# Altium project Custome Arduino Zlab_Fanap.PrjPcb
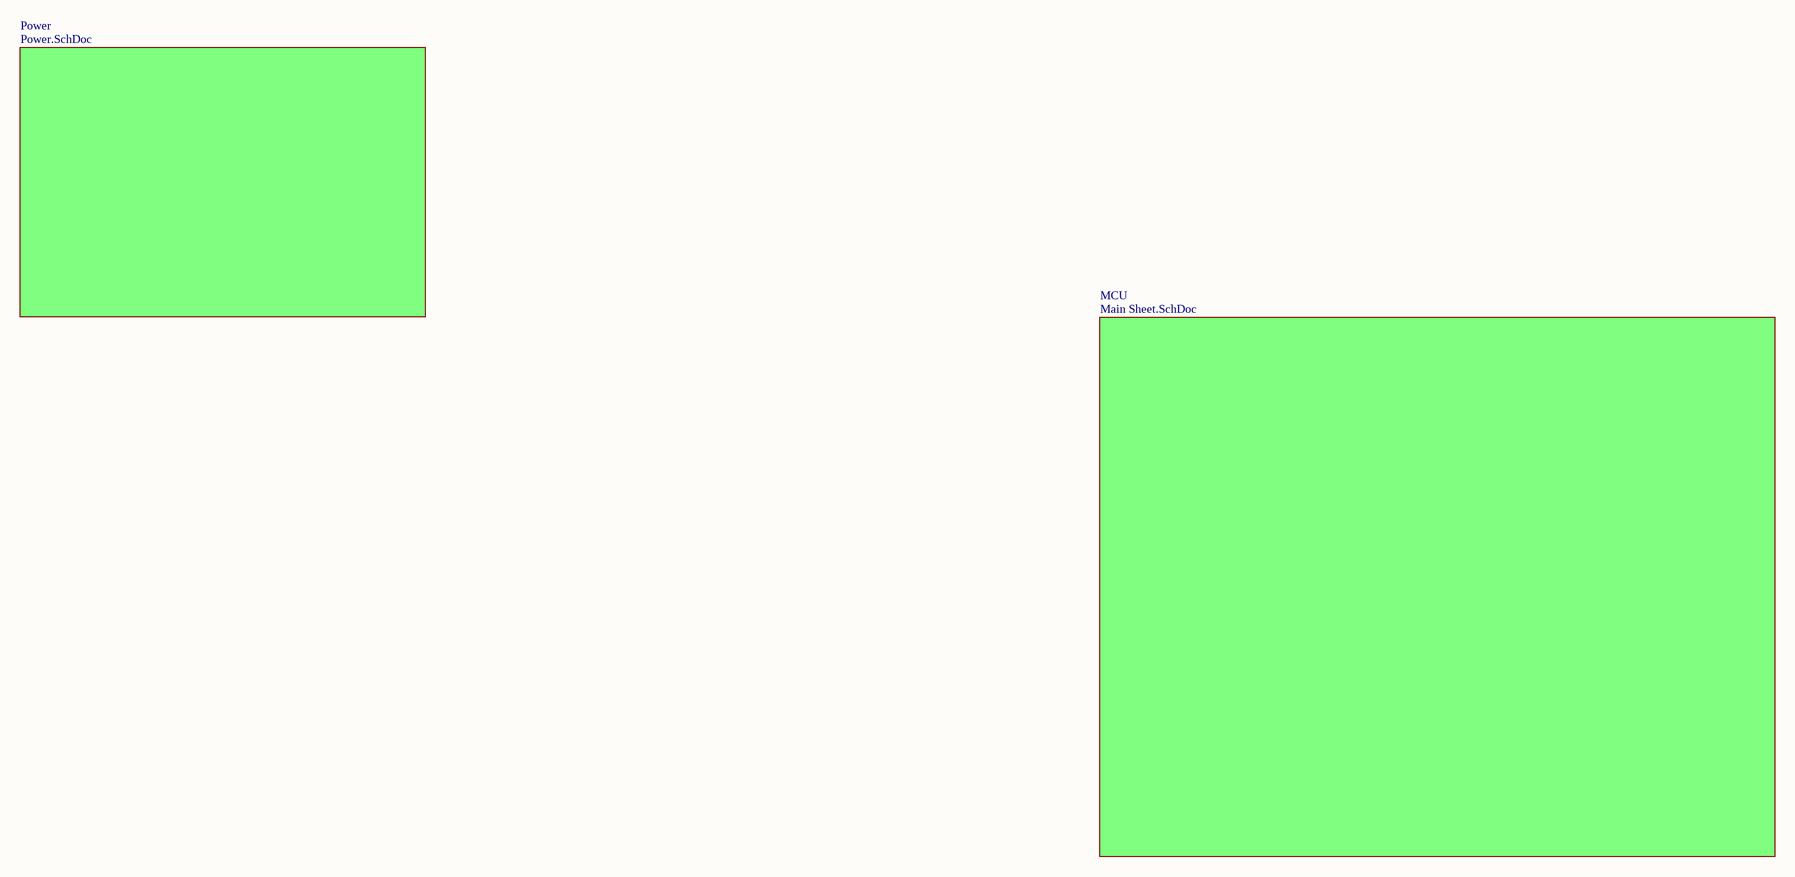
[diagram p0: Block Diagram.SchDoc]
3 sheets, 64 parts. Net scope: global (net labels, ports and power ports of the same name join across sheets).
Board file: Custome Arduino Zlab_Fanap.PcbDoc
Sheets:
  Block Diagram.SchDoc
    Power = Power.SchDoc
    MCU = Main Sheet.SchDoc

## Sheet Block Diagram.SchDoc
size 420 x 297 mm; SheetNumber: 1; SheetTotal: 3

### Sub-sheets
MCU = Main Sheet.SchDoc: no entries
Power = Power.SchDoc: no entries

### Notes on the sheet
- THIS DOCUMENT AND THE DATA DISCLOSED HEREIN OR
- HEREWITH IS THE PROPERTY OF ALTIUM LIMITED AND MAY
- DWG NO:
- REVISION
- REV:
- DESCRIPTION
- DATE
- APPROVED
- BE FREELY DISTRIBUTED IN WHOLE. NO RIGHTS ARE
- RESERVED OR EXPRESS OR IMPLIED WARANTEE GIVEN.
- ENG:
- APPROVALS
- PROJECT
- DSN:
- CHK:
- REFERENCE DOCUMENTS
- PROJECT REVISION:
- TITLE
- DOCUMENT REVISION:
- DESIGN ITEM:
- BOM:
- FAB DWG:
- PCB DWG:
- ASSY DWG:
- SCALE:
- A3
- SIZE
- CAGE CODE
- FILE NAME
- DWG NO.
- SHEET
- OF
- REV

## Sheet Power.SchDoc
size 420 x 297 mm; SheetNumber: 2; SheetTotal: 3
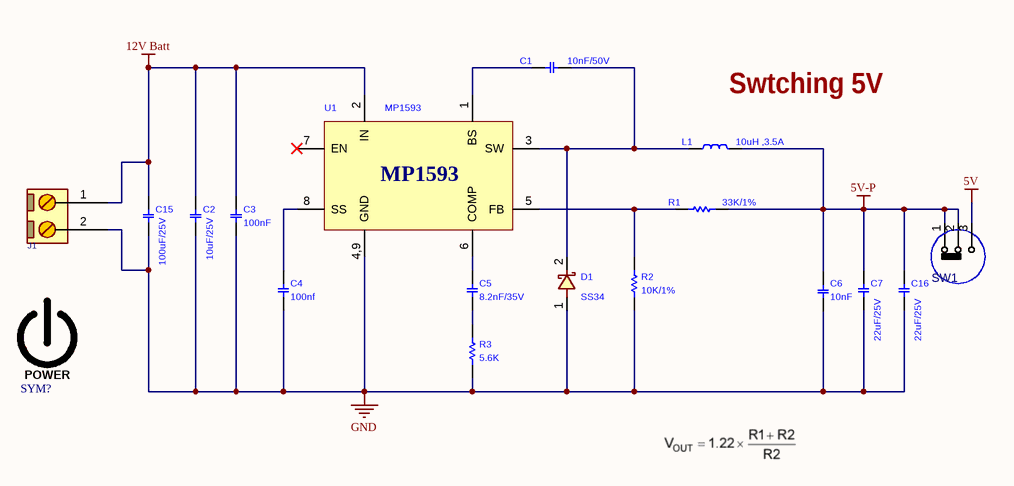
[diagram p1: Power.SchDoc]

### Parts
C1  10nF/50V  [C0603S]
C2  10uF/25V  [C0805S]
C3  100nF  [C0603S]
C4  100nf  [C0603S]
C5  8.2nF/35V  [C0603S]
C6  10nF  [C0603S]
C7  22uF/25V  [C0805S]
C15  100uF/25V  [C1206S]
C16  22uF/25V  [C0805S]
D1  SS34  [D_SMA]
J1  CONN_TB2  [TBG_2]  (value not drawn)
L1  10uH ,3.5A  [L_4_H2]
R1  33K/1%  [R0603S]
R2  10K/1%  [R0603S]
R3  5.6K  [R0603S]
SW1  SlideSwitch  [SWSLIDT_SPDT_R_8X4]  (value not drawn)
SYM?  POWER  [SYM_POWER]  (value not drawn)  (graphical)
U1  MP1593  [SO_8T]

### Nets
5V: SW1.3(P4)
5V-P: C6.2 C7.2 C16.2 L1.2 R1.1 SW1.1(P1) SW1.2(P3)
12V Batt: C2.2 C3.2 C15.2 J1.1 U1.2(IN)
GND: C2.1 C3.1 C4.1 C6.1 C7.1 C15.1 C16.1 D1.1 J1.2 R2.1 R3.1 U1.4,9(GND)
NetC1_1: C1.1 D1.2 L1.1 U1.3(SW)
NetC1_2: C1.2 U1.1(BS)
NetC4_2: C4.2 U1.8(SS)
NetC5_1: C5.1 R3.2
NetC5_2: C5.2 U1.6(COMP)
NetR1_2: R1.2 R2.2 U1.5(FB)

Not connected (* = marked no-connect by the designer): U1 7(EN)*

### Notes on the sheet
- (near L1) Swtching 5V
- THIS DOCUMENT AND THE DATA DISCLOSED HEREIN OR
- HEREWITH IS THE PROPERTY OF ALTIUM LIMITED AND MAY
- DWG NO:
- REVISION
- REV:
- DESCRIPTION
- DATE
- APPROVED
- BE FREELY DISTRIBUTED IN WHOLE. NO RIGHTS ARE
- RESERVED OR EXPRESS OR IMPLIED WARANTEE GIVEN.
- ENG:
- APPROVALS
- PROJECT
- DSN:
- CHK:
- REFERENCE DOCUMENTS
- PROJECT REVISION:
- TITLE
- DOCUMENT REVISION:
- DESIGN ITEM:
- BOM:
- FAB DWG:
- PCB DWG:
- ASSY DWG:
- SCALE:
- A3
- SIZE
- CAGE CODE
- FILE NAME
- DWG NO.
- SHEET
- OF
- REV

### Library data of the parts
C1 C6 = CAP_SMD_MLCC_0603: CAP, MLCC, SMD; MANF_P#: x; MA: MA010200501; MANF: x; ASSEMBLY: ASSEMBLY; Pricing: 1=0.44, 10=0.34; Published: 31-Dec-2024; Publisher: CHILA Board; LatestRevisionDate: 31-Dec-2024; LatestRevisionNote: Re-released for DXP Platform.; PackageReference: x; footprint: x; package: 0603
  C1: VALUE: 10nF/50V
  C6: VALUE: 10nF
C2 C15 = CAP_SMD_MLCC_0603: CAP, MLCC, SMD; MANF_P#: x; MA: MA010200491; MANF: x; ASSEMBLY: ASSEMBLY; Pricing: 1=0.44, 10=0.34; Published: 31-Dec-2024; Publisher: CHILA Board; LatestRevisionDate: 31-Dec-2024; LatestRevisionNote: Re-released for DXP Platform.; PackageReference: x; footprint: x; package: 0603
  C2: VALUE: 10uF/25V
  C15: VALUE: 100uF/25V
C3 C4 = CAP_SMD_MLCC_0603: CAP, MLCC, SMD; MANF_P#: x; MA: MA010210354; MANF: x; ASSEMBLY: ASSEMBLY; Pricing: 1=0.44, 10=0.34; Published: 31-Dec-2024; Publisher: CHILA Board; LatestRevisionDate: 31-Dec-2024; LatestRevisionNote: Re-released for DXP Platform.; PackageReference: x; footprint: x; package: 0603
  C3: VALUE: 100nF
  C4: VALUE: 100nf
C5 = CAP_SMD_MLCC_0603: CAP, MLCC, SMD; MANF_P#: x; MA: MA010210616; MANF: x; ASSEMBLY: ASSEMBLY; VALUE: 8.2nF/35V; Pricing: 1=0.44, 10=0.34; Published: 31-Dec-2024; Publisher: CHILA Board; LatestRevisionDate: 31-Dec-2024; LatestRevisionNote: Re-released for DXP Platform.; PackageReference: x; footprint: x; package: 0603
C7 C16 = CAP_SMD_MLCC_0603: CAP, MLCC, SMD; MANF_P#: x; MA: MA010200438; MANF: x; ASSEMBLY: ASSEMBLY; VALUE: 22uF/25V; Pricing: 1=0.44, 10=0.34; Published: 31-Dec-2024; Publisher: CHILA Board; LatestRevisionDate: 31-Dec-2024; LatestRevisionNote: Re-released for DXP Platform.; PackageReference: x; footprint: x; package: 0805
D1 = DIODE_SMD_SCHOTTKY_B340A: DIODE, SCHOTTKY, 40V, 3A; MANF: x; MA: MA010400129; MANF_P#: x; ASSEMBLY: ASSEMBLY; VALUE: SS34; Pricing: 1=0.44, 10=0.34; Published: 31-Dec-2024; Publisher: CHILA Board; LatestRevisionDate: 31-Dec-2024; LatestRevisionNote: Re-released for DXP Platform.; PackageReference: x; footprint: x; package: SMA
J1 = CONN_TB2: CONN, TERMINAL BLOCK, 5.08mm pitch; VALUE: CONN_TB2
L1 = TMPC 0603H-100MG-D: Shielded Molded Inductor, SMD; MA: MA011210087; MANF: x; Pricing: 1=0.44, 10=0.34; ASSEMBLY: ASSEMBLY; MANF_P#: x; Published: 31-Dec-2024; Publisher: CHILA Board; Value: 10uH ,3.5A; LatestRevisionDate: 31-Dec-2024; LatestRevisionNote: Re-released for DXP Platform.; PackageReference: x; footprint: x; package: Inductor 8*8
R1 = RES_SMD_0603: RESISTOR, SMD; MANF_P#: x; MA: MA010110563; MANF: x; ASSEMBLY: ASSEMBLY; VALUE: 33K/1%; Pricing: 1=0.44, 10=0.34; Published: 31-Dec-2024; Publisher: CHILA Board; LatestRevisionDate: 31-Dec-2024; LatestRevisionNote: Re-released for DXP Platform.; PackageReference: x; footprint: x; package: 0603
R2 = RES_SMD_0603: RESISTOR, SMD; MANF_P#: x; MA: MA010110324; MANF: x; ASSEMBLY: ASSEMBLY; VALUE: 10K/1%; Pricing: 1=0.44, 10=0.34; Published: 31-Dec-2024; Publisher: CHILA Board; LatestRevisionDate: 31-Dec-2024; LatestRevisionNote: Re-released for DXP Platform.; PackageReference: x; footprint: x; package: 0603
R3 = RES_SMD_0603: RESISTOR, SMD; MANF_P#: x; MA: MA010110557; MANF: x; ASSEMBLY: ASSEMBLY; VALUE: 5.6K; Pricing: 1=0.44, 10=0.34; Published: 31-Dec-2024; Publisher: CHILA Board; LatestRevisionDate: 31-Dec-2024; LatestRevisionNote: Re-released for DXP Platform.; PackageReference: x; footprint: x; package: 0603
SW1 = SWSLIDT_SPDT_S_8X4: SWITCH, SLIDE, SPDT, 8.6X4.3mm, THD; MANF_PART#: OS102011MS2QN1; MANF: C&K; DESC: DESCRIPTION; VALUE: SlideSwitch; ASSEMBLY: ASSEMBLY; PARAM: PARAM; PRICE: 0.4$
SYM? = SYM_POWER: Symbol, POWER, 4.6X6.3mm; ASSEMBLY: DNP; VALUE: POWER
U1 = MP1593DN: IC REG BUCK ADJ 3A SYNC; MA: MA010510512; MANF: x; Pricing: 1=0.44, 10=0.34; ComponentLink1URL: http://www.mouser.com/ds/2/277/MP1593_r2.11-476720.pdf?src-supplier=Mouser; ASSEMBLY: ASSEMBLY; MANF_P#: x; Published: 31-Dec-2024; Publisher: CHILA Board; Value: MP1593; LatestRevisionDate: 31-Dec-2024; LatestRevisionNote: Re-released for DXP Platform.; PackageReference: x; footprint: x; package: Sop8

## Sheet Main Sheet.SchDoc
size 420 x 297 mm; SheetNumber: 3; SheetTotal: 3
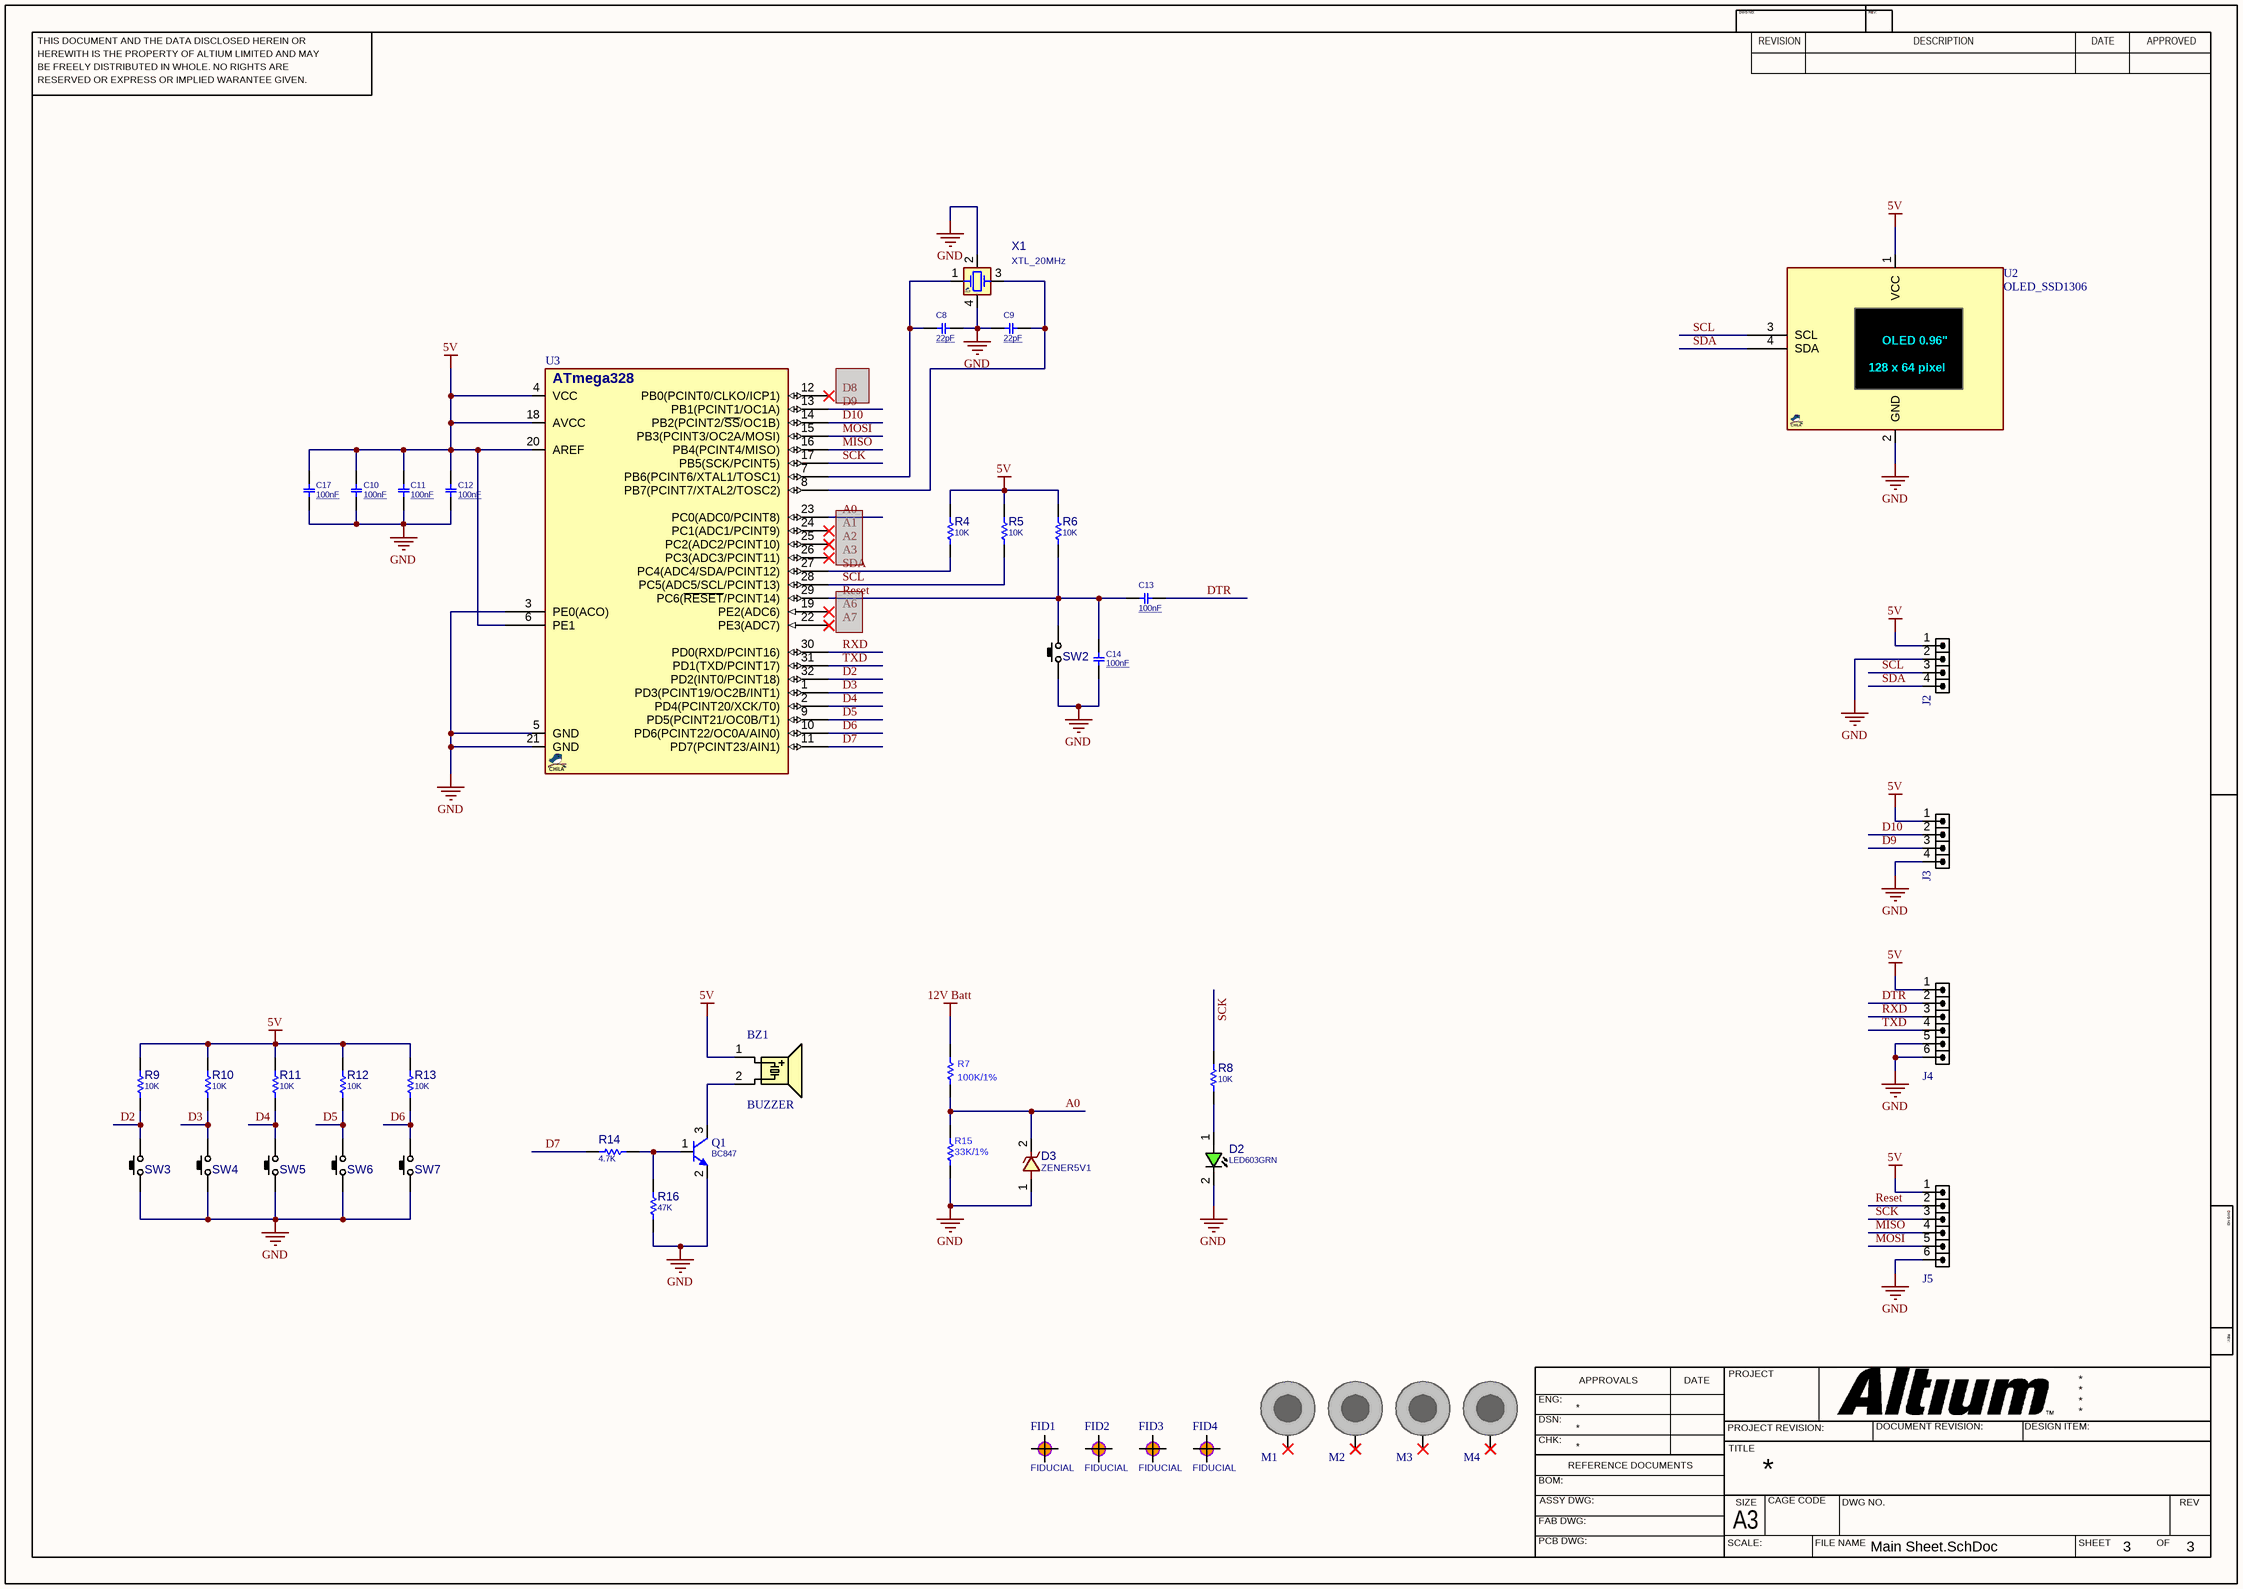
[diagram p2: Main Sheet.SchDoc]

### Parts
BZ1  BUZZER  [BZ_C9]
C8  22pF  [C0603S]
C9  22pF  [C0603S]
C10  100nF  [C0603S]
C11  100nF  [C0603S]
C12  100nF  [C0603S]
C13  100nF  [C0603S]
C14  100nF  [C0603S]
C17  100nF  [C0603S]
D2  LED603GRN  [LED0603GRN]
D3  ZENER5V1  [D_SOD123W]
FID1  FIDUCIAL  [FIDUCIAL1SM3]  (graphical)
FID2  FIDUCIAL  [FIDUCIAL1SM3]  (graphical)
FID3  FIDUCIAL  [FIDUCIAL1SM3]  (graphical)
FID4  FIDUCIAL  [FIDUCIAL1SM3]  (graphical)
J2  HDR1X4  [HDR_M_1X4]  (value not drawn)
J3  HDR1X4  [HDR_M_1X4]  (value not drawn)
J4  HDR1X6  [HDR_M_1X6]  (value not drawn)
J5  HDR1X6  [HDR_M_1X6]  (value not drawn)
M1  DNP/MH  [SCMH_M3]  (value not drawn)  (no BOM)
M2  DNP/MH  [SCMH_M3]  (value not drawn)  (no BOM)
M3  DNP/MH  [SCMH_M3]  (value not drawn)  (no BOM)
M4  DNP/MH  [SCMH_M3]  (value not drawn)  (no BOM)
Q1  BC847  [SOT23_3]
R4  10K  [R0603S]
R5  10K  [R0603S]
R6  10K  [R0603S]
R7  100K/1%  [R0603S]
R8  10K  [R0603S]
R9  10K  [R0603S]
R10  10K  [R0603S]
R11  10K  [R0603S]
R12  10K  [R0603S]
R13  10K  [R0603S]
R14  4.7K  [R0603S]
R15  33K/1%  [R0603S]
R16  47K  [R0603S]
SW2  PUSHBUTTON  [SWPBS_SPST_6X3X5]  (value not drawn)
SW3  PUSHBUTTON  [SWPBS_SPST_6X3X5]  (value not drawn)
SW4  PUSHBUTTON  [SWPBS_SPST_6X3X5]  (value not drawn)
SW5  PUSHBUTTON  [SWPBS_SPST_6X3X5]  (value not drawn)
SW6  PUSHBUTTON  [SWPBS_SPST_6X3X5]  (value not drawn)
SW7  PUSHBUTTON  [SWPBS_SPST_6X3X5]  (value not drawn)
U2  OLED_SSD1306  [OLED_SSD1306_64_I2C]
U3  ATMEGA328  [QFG80_32]  (value not drawn)
X1  XTL_20MHz  [XTL_4_3225]

### Nets
5V: BZ1.1(A) C10.2 C11.2 C12.2 C17.2 J2.1 J3.1 J4.1 J5.1 R4.2 R5.2 R6.2 R9.2 R10.2 R11.2 R12.2 R13.2 U2.1(VCC) U3.4(VCC) U3.6(PE1) U3.18(AVCC) U3.20(AREF)
12V Batt: R7.2
GND: C8.2 C9.1 C10.1 C11.1 C12.1 C14.1 C17.1 D2.2(CATHODE) D3.1 J2.2 J3.4 J4.5 J4.6 J5.6 Q1.2(E) R15.2 R16.2 SW2.1(P1) SW3.1(P1) SW4.1(P1) SW5.1(P1) SW6.1(P1) SW7.1(P1) U2.2(GND) U3.3(PE0(ACO)) U3.5(GND) U3.21(GND) X1.2(GND2) X1.4(GND4)
A0: D3.2 R7.1 R15.1
D2: R9.1 SW3.2(P3) U3.32(PD2(INT0/PCINT18))
D3: R10.1 SW4.2(P3) U3.1(PD3(PCINT19/OC2B/INT1))
D4: R11.1 SW5.2(P3) U3.2(PD4(PCINT20/XCK/T0))
D5: R12.1 SW6.2(P3) U3.9(PD5(PCINT21/OC0B/T1))
D6: R13.1 SW7.2(P3) U3.10(PD6(PCINT22/OC0A/AIN0))
D7: R14.2 U3.11(PD7(PCINT23/AIN1))
D9: J3.3 U3.13(PB1(PCINT1/OC1A))
D10: J3.2 U3.14(PB2(PCINT2/~{SS}/OC1B))
DTR: C13.1 J4.2
MISO: J5.4 U3.16(PB4(PCINT4/MISO))
MOSI: J5.5 U3.15(PB3(PCINT3/OC2A/MOSI))
Reset: J5.2
RXD: J4.3 U3.30(PD0(RXD/PCINT16))
SCK: J5.3 R8.2 U3.17(PB5(SCK/PCINT5))
SCL: J2.3 R5.1 U2.3(SCL) U3.28(PC5(ADC5/SCL/PCINT13))
SDA: J2.4 R4.1 U2.4(SDA) U3.27(PC4(ADC4/SDA/PCINT12))
TXD: J4.4 U3.31(PD1(TXD/PCINT17))
NetBZ1_2: BZ1.2(B) Q1.3(C)
NetC8_1: C8.1 U3.7(PB6(PCINT6/XTAL1/TOSC1)) X1.1
NetC9_2: C9.2 U3.8(PB7(PCINT7/XTAL2/TOSC2)) X1.3
NetC13_2: C13.2 C14.2 R6.1 SW2.2(P3) U3.29(PC6(~{RESET}/PCINT14))
NetD2_1: D2.1(ANODE) R8.1
NetQ1_1: Q1.1(B) R14.1 R16.1

Not connected (* = marked no-connect by the designer): M1 1*; M2 1*; M3 1*; M4 1*; U3 12(PB0(PCINT0/CLKO/ICP1))* 19(PE2(ADC6))* 22(PE3(ADC7))* 23(PC0(ADC0/PCINT8)) 24(PC1(ADC1/PCINT9))* 25(PC2(ADC2/PCINT10))* 26(PC3(ADC3/PCINT11))*

### Notes on the sheet
- THIS DOCUMENT AND THE DATA DISCLOSED HEREIN OR
- HEREWITH IS THE PROPERTY OF ALTIUM LIMITED AND MAY
- DWG NO:
- REVISION
- REV:
- DESCRIPTION
- DATE
- APPROVED
- BE FREELY DISTRIBUTED IN WHOLE. NO RIGHTS ARE
- RESERVED OR EXPRESS OR IMPLIED WARANTEE GIVEN.
- ENG:
- APPROVALS
- PROJECT
- DSN:
- CHK:
- REFERENCE DOCUMENTS
- PROJECT REVISION:
- TITLE
- DOCUMENT REVISION:
- DESIGN ITEM:
- BOM:
- FAB DWG:
- PCB DWG:
- ASSY DWG:
- SCALE:
- A3
- SIZE
- CAGE CODE
- FILE NAME
- DWG NO.
- SHEET
- OF
- REV
- (in symbol ATMEGA328PB_QFN32) ATmega328
- (in symbol OLED_SSD1306_64_I2C) OLED 0.96"; 128 x 64 pixel

### Library data of the parts
BZ1 = BUZZER_C9: Buzzer, 9mm, Magnetic Transducer; MANF: Mallory; MANF_P#: PB-09N23P-03Q; PARAM2: 3V, 30mA; PARAM: 2.7KHz; PRICE: $3; VALUE: BUZZER
C8-C14 C17 = CAP_SMD_MLCC: CAP, MLCC, 1nF, 50V, C0G, 10%, 0402; MANF_P#: MANF_PART#; MANF: Murata; PARAM: C0G, 10%; PRICE: 100= 1$; DESC: CAP, MLCC, 1nF, 50V, C0G, 10%, 0402; PARAM2: 50V; ASSEMBLY: ASSEMBLY
  C8 C9: VALUE: 22pF
  C10-C14 C17: VALUE: 100nF
D2 = LED_SMD_0603_GRN: LED, SMD, 0603, GREEN; PARAM: 20mA; MANF: Kingbright; DESC: DESCRIPTION; MANF_P#: APT1608SGC; PARAM2: 2.2V; ASSEMBLY: ASSEMBLY; PRICE: 1: 0.14$, 100: 6.8$; VALUE: LED603GRN
D3 = DIODE_SMD_ZENER_DFLZ5V1: DIODE, ZENER, 1W, 5.1V; MANF: Diodes; DESC: DESCRIPTION; PARAM2: 1W, 4Ohm, -55~150oC; MANF_P#: DFLZ5V1-7; ASSEMBLY: ASSEMBLY; PRICE: 0.5$; PARAM: 5.1V; VALUE: ZENER5V1
FID1-FID4 = FIDUCIAL1SM3: FIDUCIAL PCB ASSEMBLY AUTOMATED SMT; ASSEMBLY: DNP; VALUE: FIDUCIAL
J2 J3 = HDR_M_1X4: CONN, HEADER, Male, pitch: 2.54mm, 4POS; VALUE: HDRM4
J4 J5 = HDR_M_1X6: CONN, HEADER, Male, pitch: 2.54mm, 6POS; VALUE: HDRM6
M1-M4 = SCMH_M3: SCREW mouting, M3, 3.0mm diameter and 6.0mm PanHead; ASSEMBLY: DNP; VALUE: DNP/MH
Q1 = NPN_BC847_SOT23: BJT, NPN, 45v, 0.1A, SOT23; PARAM: 0.1A, Hfe110~800; PARAM2: 45v, 500mW; MANF_P#: BC847BLT; MANF: NXP, ON; VALUE: BC847
R4-R6 R8-R14 R16 = RES_SMD: RESISTOR, SMD; PARAM: -W; DESC: DESCRIPTION; DIST#: MOUSER; PARAM2: 1%; MANF_P#: -; MANF: -; ASSEMBLY: ASSEMBLY; PRICE: 100= 0.5$
  R4-R6 R8-R13: VALUE: 10K
  R14: VALUE: 4.7K
  R16: VALUE: 47K
R7 = RES_SMD_0603: as R2 on sheet Power; MANF: x; ASSEMBLY: ASSEMBLY; VALUE: 100K/1%; Pricing: 1=0.44, 10=0.34; Published: 31-Dec-2024; Publisher: CHILA Board; LatestRevisionDate: 31-Dec-2024; LatestRevisionNote: Re-released for DXP Platform.; PackageReference: x; footprint: x; package: 0603
R15 = RES_SMD_0603: as R1 on sheet Power; MANF: x; ASSEMBLY: ASSEMBLY; VALUE: 33K/1%; Pricing: 1=0.44, 10=0.34; Published: 31-Dec-2024; Publisher: CHILA Board; LatestRevisionDate: 31-Dec-2024; LatestRevisionNote: Re-released for DXP Platform.; PackageReference: x; footprint: x; package: 0603
SW2-SW7 = SWPBS_SPST_6X3X5: SWITCH, PUSH BUTTON, TACTILE, SMD, SPST, 6X3.5X5mm; MANF: ALPS; DESC: DESCRIPTION; MANF_P#: SKQMBBE010; VALUE: PUSHBUTTON; ASSEMBLY: ASSEMBLY; PARAM: PARAM; PRICE: PRICE
U2 = OLED_SSD1306_64_I2C: OLED, SSD1306, 0.96", 128X64, BREAKOUT I2C; MANF_P#: OLED_SSD1306_I2C; PARAM2: 3.3/5VCC, -20~70oC; PARAM: 2 Colors, 0.96", 128X64; MANF: -; VALUE: OLED_SSD1306
U3 = ATMEGA328PB_QFN32: MCU, AVR, 8-Bit, 16KB, 1KB RAM, 20MHz; PART#ALT: ATmega8-48-88-168-328; MANF_P#: ATMEGA328PB-MN; DESC: 1KB EEPROM; MANF: ATMEL/MICROCHIP; PARAM2: 1.8~5.5V; PARAM: 32KB, 2KB RAM, 20MHz, -40~85°C; PRICE: 1.4$; VALUE: ATMEGA328
X1 = XTL_4_25MHZ_3225A: CRYSTAL 25.00 MHZ 18pF, 50PPM; MANF: ABRACON; DESC: DESCRIPTION; DIST#: MOUSER; MANF_P#: ABM8-25.000MHZ-B2-T; PARAM2: 0.5$; ASSEMBLY: ASSEMBLY; PARAM: 50PPM; PRICE: PRICE; VALUE: XTL_20MHz

## Nets that join several sheets
5V: Power (SW1.3), Main Sheet (22 pins)
12V Batt: Power (5 pins), Main Sheet (R7.2)
GND: Power (12 pins), Main Sheet (29 pins)